# Altium schematic sheet Motor_control.SchDoc
size A4
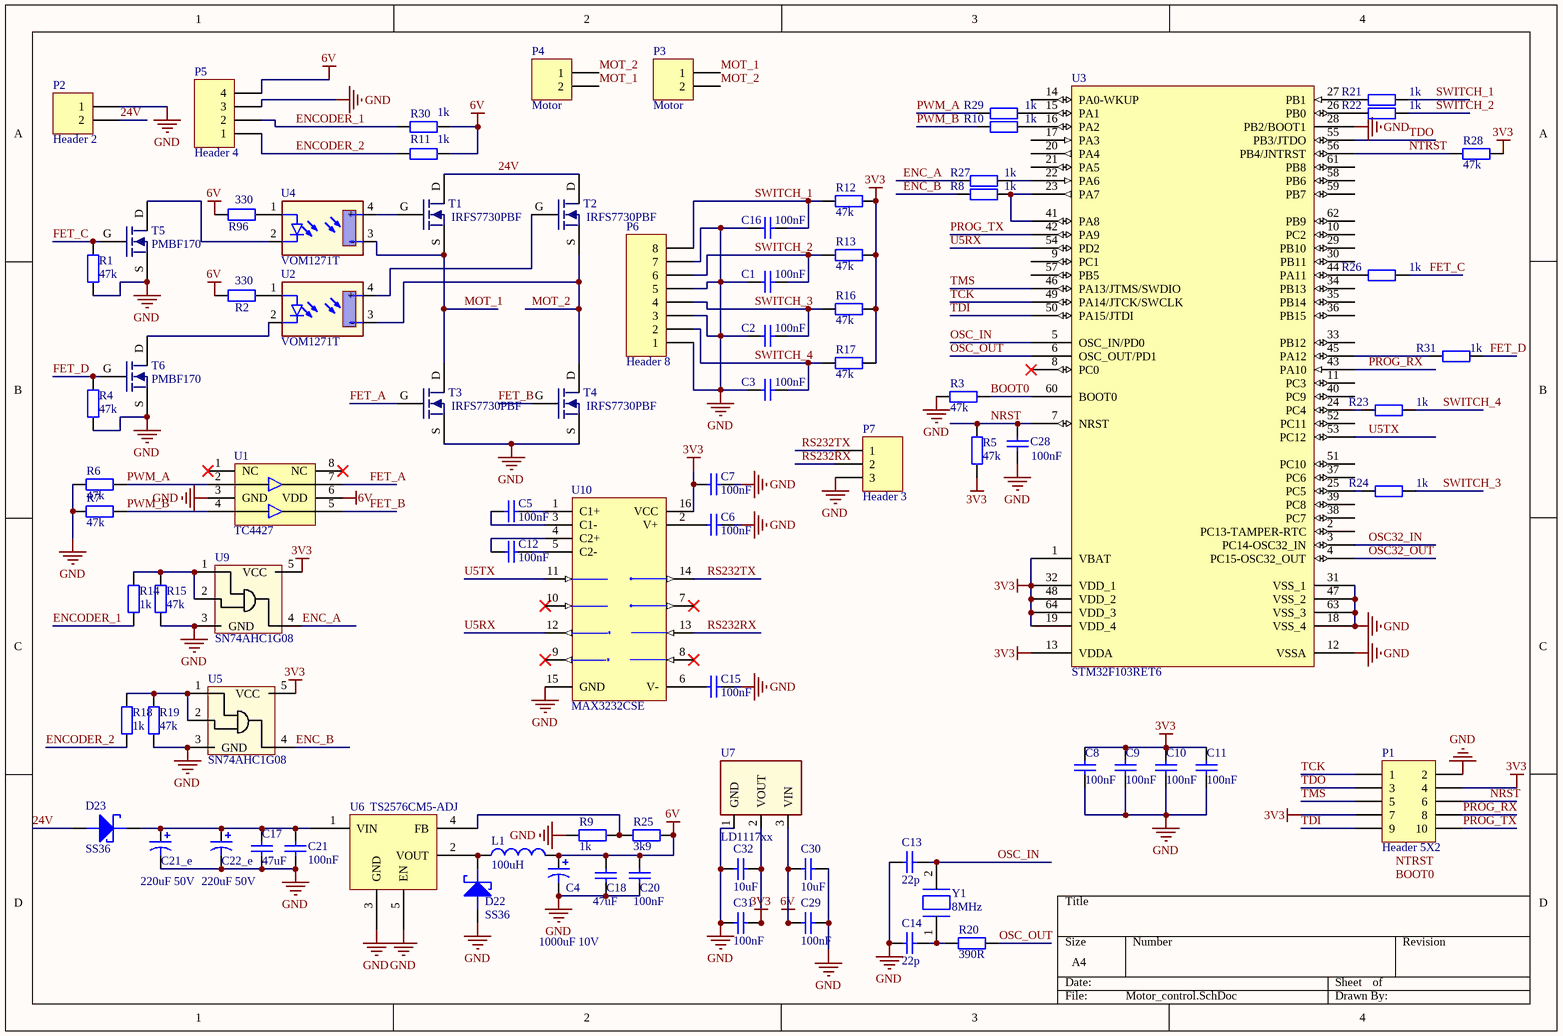
[diagram p0: Motor_control.SchDoc]

## Parts
C1  100nF  [FP_0603_CAP_080]
C2  100nF  [FP_0603_CAP_080]
C3  100nF  [FP_0603_CAP_080]
C4  1000uF 10V  [CAP_ALU_ELKO_10D_10,5H]
C5  100nF  [FP_0603_CAP_080]
C6  100nF  [FP_0603_CAP_080]
C7  100nF  [FP_0603_CAP_080]
C8  100nF  [FP_0603_CAP_080]
C9  100nF  [FP_0603_CAP_080]
C10  100nF  [FP_0603_CAP_080]
C11  100nF  [FP_0603_CAP_080]
C12  100nF  [FP_0603_CAP_080]
C13  22p  [FP_0603_CAP_080]
C14  22p  [FP_0603_CAP_080]
C15  100nF  [FP_0603_CAP_080]
C16  100nF  [FP_0603_CAP_080]
C17  47uF  [FP_1206_CAP_125]
C18  47uF  [FP_1206_CAP_125]
C20  100nF  [FP_0603_CAP_080]
C21  100nF  [FP_0603_CAP_080]
C21_e  220uF 50V  [CAP_ALU_ELKO_10D_10,5H]
C22_e  220uF 50V  [CAP_ALU_ELKO_10D_10,5H]
C28  100nF  [FP_0603_CAP_080]
C29  100nF  [FP_0603_CAP_080]
C30  10uF  [FP_1206_CAP_085]
C31  100nF  [FP_0603_CAP_080]
C32  10uF  [FP_1206_CAP_085]
D22  SS36  [DIODE_SMC]
D23  SS36  [DIODE_SMC]
L1  100uH  [SRR1206_T]
P1  Header 5X2  [HEADER_10_BOX]
P2  Header 2  [Sorkapocs 2P 5mm]
P3  Motor  [Sorkapocs 2P 5mm]
P4  Motor  [3.96mm 2P  90° NCW396-02R]
P5  Header 4  [jst-s4b-xh-a]
P6  Header 8  [Sorkapocs 8P 5mm]
P7  Header 3  [Sorkapocs 3P 5mm]
R1  47k  [FP_0603_RES]
R2  330  [FP_0603_RES]
R3  47k  [FP_0603_RES]
R4  47k  [FP_0603_RES]
R5  47k  [FP_0603_RES]
R6  47k  [FP_0603_RES]
R7  47k  [FP_0603_RES]
R8  1k  [FP_0603_RES]
R9  1k  [FP_0603_RES]
R10  1k  [FP_0603_RES]
R11  1k  [FP_0603_RES]
R12  47k  [FP_0603_RES]
R13  47k  [FP_0603_RES]
R14  1k  [FP_0603_RES]
R15  47k  [FP_0603_RES]
R16  47k  [FP_0603_RES]
R17  47k  [FP_0603_RES]
R18  1k  [FP_0603_RES]
R19  47k  [FP_0603_RES]
R20  390R  [FP_0603_RES]
R21  1k  [FP_0603_RES]
R22  1k  [FP_0603_RES]
R23  1k  [FP_0603_RES]
R24  1k  [FP_0603_RES]
R25  3k9  [FP_0603_RES]
R26  1k  [FP_0603_RES]
R27  1k  [FP_0603_RES]
R28  47k  [FP_0603_RES]
R29  1k  [FP_0603_RES]
R30  1k  [FP_0603_RES]
R31  1k  [FP_0603_RES]
R96  330  [FP_0603_RES]
T1  IRFS7730PBF  [FET_D2-PAK_7]
T2  IRFS7730PBF  [FET_D2-PAK_7]
T3  IRFS7730PBF  [FET_D2-PAK_7]
T4  IRFS7730PBF  [FET_D2-PAK_7]
T5  PMBF170  [FET_SOT23]
T6  PMBF170  [FET_SOT23]
U1  TC4427  [DIGITAL_SOIC8]
U2  VOM1271T  [OPTO_SOP-4]
U3  STM32F103RET6  [LQFP64_N]
U4  VOM1271T  [OPTO_SOP-4]
U5  SN74AHC1G08  [GATE_SOT23-5]
U6  TS2576CM5-ADJ  [SUPPLY_TO-263 5]
U7  LD1117xx  [SUPPLY_SOT223]
U9  SN74AHC1G08  [GATE_SOT23-5]
U10  MAX3232CSE  [DIGITAL_SOIC16]
Y1  value 8MHz  [FP_CRYSTAL_HC49_SMD]  (hidden comment: 8MHz Quartz HC49)

## Nets
3V3: C7.2 C8.2 C9.2 C10.2 C11.2 C31.1 C32.2 P1.4 P1.7 R5.2 R12.2 R13.2 R16.2 R17.2 R28.2 U3.1(VBAT) U3.13(VDDA) U3.19(VDD_4) U3.32(VDD_1) U3.48(VDD_2) U3.64(VDD_3) U5.5(VCC) U7.2(VOUT) U9.5(VCC) U10.16(VCC)
6V: C4.P C18.2 C20.1 C29.2 C30.1 L1.2 P5.4 R2.2 R11.2 R25.1 R30.2 R96.2 U1.6(VDD) U7.3(VIN)
GND: C1.1 C2.1 C3.1 C4.N C6.1 C7.1 C8.1 C9.1 C10.1 C11.1 C13.1 C14.2 C15.1 C16.1 C17.1 C18.1 C20.2 C21.2 C21_e.N C22_e.N C28.2 C29.1 C30.2 C31.2 C32.1 D22.A P1.2 P2.1 P5.3 P6.1 P6.3 P6.5 P6.7 P7.3 R1.2 R3.1 R4.2 R6.1 R7.1 R9.1 R15.2 R19.2 T3.S T4.S T5.S T6.S U1.3(GND) U3.12(VSSA) U3.18(VSS_4) U3.28(PB2/BOOT1) U3.31(VSS_1) U3.47(VSS_2) U3.63(VSS_3) U5.3(GND) U6.3(GND) U6.5(EN) U7.1(GND) U9.3(GND) U10.15(GND)
24V: D23.A P2.2 T1.D T2.D
BOOT0: R3.2 U3.60(BOOT0)
ENC_A: R27.1 U9.4(Y)
ENC_B: R8.1 U5.4(Y)
ENCODER_1: P5.2 R14.2 R30.1
ENCODER_2: P5.1 R11.1 R18.2
FET_A: T3.G U1.7(~{OUTA})
FET_B: T4.G U1.5(OUTB)
FET_C: R1.1 R26.2 T5.G
FET_D: R4.1 R31.2 T6.G
MOT_1: P3.1 P4.2 T1.S T3.D U4.3(-)
MOT_2: P3.2 P4.1 T2.S T4.D U2.3(-)
NRST: C28.1 P1.6 R5.1 U3.7(NRST)
NTRST: R28.1 U3.56(PB4/JNTRST)
OSC32_IN: U3.3(PC14-OSC32_IN)
OSC32_OUT: U3.4(PC15-OSC32_OUT)
OSC_IN: C13.2 U3.5(OSC_IN/PD0) Y1.2
OSC_OUT: R20.2 U3.6(OSC_OUT/PD1)
PROG_RX: P1.8 U3.43(PA10)
PROG_TX: P1.10 U3.42(PA9)
PWM_A: R6.2 R29.1 U1.2(INA)
PWM_B: R7.2 R10.1 U1.4(INB)
RS232RX: P7.2 U10.13(R1IN)
RS232TX: P7.1 U10.14(T1OUT)
SWITCH_1: C16.2 P6.8 R12.1 R21.2
SWITCH_2: C1.2 P6.6 R13.1 R22.2
SWITCH_3: C2.2 P6.4 R16.1 R24.2
SWITCH_4: C3.2 P6.2 R17.1 R23.2
TCK: P1.1 U3.49(PA14/JTCK/SWCLK)
TDI: P1.9 U3.50(PA15/JTDI)
TDO: P1.3 U3.55(PB3/JTDO)
TMS: P1.5 U3.46(PA13/JTMS/SWDIO)
U5RX: U3.54(PD2) U10.12(R1OUT)
U5TX: U3.53(PC12) U10.11(T1IN)
NetC5_1: C5.1 U10.1(C1+)
NetC5_2: C5.2 U10.3(C1-)
NetC6_2: C6.2 U10.2(V+)
NetC12_1: C12.1 U10.5(C2-)
NetC12_2: C12.2 U10.4(C2+)
NetC14_1: C14.1 R20.1 Y1.1
NetC15_2: C15.2 U10.6(V-)
NetC17_2: C17.2 C21.1 C21_e.P C22_e.P D23.K U6.1(VIN)
NetD22_K: D22.K L1.1 U6.2(VOUT)
NetR2_1: R2.1 U2.1(A)
NetR8_2: R8.2 U3.23(PA7) U3.41(PA8)
NetR9_2: R9.2 R25.2 U6.4(FB)
NetR10_2: R10.2 U3.16(PA2)
NetR14_1: R14.1 R15.1 U9.1(A) U9.2(B)
NetR18_1: R18.1 R19.1 U5.1(A) U5.2(B)
NetR21_1: R21.1 U3.27(PB1)
NetR22_1: R22.1 U3.26(PB0)
NetR23_1: R23.1 U3.24(PC4)
NetR24_1: R24.1 U3.25(PC5)
NetR26_1: R26.1 U3.44(PA11)
NetR27_2: R27.2 U3.22(PA6)
NetR29_2: R29.2 U3.15(PA1)
NetR31_1: R31.1 U3.45(PA12)
NetR96_1: R96.1 U4.1(A)
NetT1_G: T1.G U4.4(+)
NetT2_G: T2.G U2.4(+)
NetT5_D: T5.D U4.2(K)
NetT6_D: T6.D U2.2(K)

Not connected (* = marked no-connect by the designer): U1 1(NC)* 8(NC)*; U3 2(PC13-TAMPER-RTC) 8(PC0)* 9(PC1) 10(PC2) 11(PC3) 14(PA0-WKUP) 17(PA3) 20(PA4) 21(PA5) 29(PB10) 30(PB11) 33(PB12) 34(PB13) 35(PB14) 36(PB15) 37(PC6) 38(PC7) 39(PC8) 40(PC9) 51(PC10) 52(PC11) 57(PB5) 58(PB6) 59(PB7) 61(PB8) 62(PB9); U10 7(T2OUT)* 8(R2IN)* 9(R2OUT)* 10(T2IN)*

## Notes on the sheet
- Labels drawn without touching a wire or pin: BOOT0, NTRST

## Library data of the parts
C1-C3 C16 = Cap: Capacitor; Tûrés: 10%; Voltage: 50V; Value: 100nF; Order info: 82-04-85
C4 = Cap Pol1: Polarized Capacitor (Radial); Leírás: Capacitor electrolytic 1000uF 10V 10x10.2; Value: 1000uF 10V; Order info: 91-01-02
C5-C12 C15 = CAP: Capacitor; Tûrés: 10%; Value: 100nF; Order info: 82-04-85
C13 C14 = Cap: Capacitor; Published: 8-Jun-2000; LatestRevisionDate: 17-Jul-2002; LatestRevisionNote: Re-released for DXP Platform.; PackageReference: RAD-0.3; Publisher: Altium Limited; Value: 22p; Order info: 82-02-18
C17 C18 C20 C21 C28 C29 C31 = Cap: Capacitor; Tûrés: 10%
  C17 C18: Value: 47uF; Order info: 82-08-04
  C20 C21 C28: Value: 100nF; Order info: 82-04-85
  C29 C31: Published: 8-Jun-2000; LatestRevisionDate: 17-Jul-2002; LatestRevisionNote: Re-released for DXP Platform.; PackageReference: RAD-0.3; Publisher: Altium Limited; Value: 100nF; Order info: 82-04-85
C21_e C22_e = Cap Pol1: Polarized Capacitor (Radial); Leírás: Capacitor electrolytic 220uF 50V 10x10.2; Value: 220uF 50V; Order info: 91-00-96
C30 C32 = Cap: Capacitor; Value: 100nF; Tûrés: 20% X7R; Published: 8-Jun-2000; LatestRevisionDate: 17-Jul-2002; LatestRevisionNote: Re-released for DXP Platform.; PackageReference: RAD-0.3; Publisher: Altium Limited; Order info: 82-08-03
D22 D23 = SCHOTTKY: NXP - PMEG3020EJ,115 - SCHOTTKY RECT 30V 2A SOD323F; Leírás: Diode 3A 60V DO-214AB SCH.RECT. SS36; Order info: 83-02-57
L1 = Inductor: Code_IEC: 1005; Published: 8-Jun-2000; LatestRevisionDate: 29-May-2009; LatestRevisionNote: IPC-7351 Footprint Added.; PackageReference: 0402-A; Publisher: Altium Limited; PackageDescription: Chip Inductor; Code_JEITA: 0402; Order info: 93-03-42
P1 = Header 5X2: Header, 5-Pin, Dual row; LatestRevisionDate: 17-Jul-2002; LatestRevisionNote: Re-released for DXP Platform.; Publisher: Altium Limited; Order info: 43-20-93
P2-P4 = Header 2: Header, 2-Pin
  P2 P3: Order info: 43-06-54
  P4: Order info: 43-12-66
P5 = Header 4: Header, 4-Pin; Order info: 43-17-55
P6 = Header 8: Header, 8-Pin; Order info: 4 db: 43-06-54
P7 = Header 3: Header, 3-Pin; Order info: 43-06-55
R1 R3-R19 R21-R31 = Res3: Resistor; Tûrés: 5%
  R1 R3-R7 R12 R13 R15-R17 R19 R28: Value: 47k; Order info: 81-10-46
  R8-R11 R14 R18 R21-R24 R26 R27 R29-R31: Value: 1k; Order info: 81-10-26
  R25: Value: 3k9; Order info: 81-10-33
R2 R96 = Res3: Resistor; Tûrés: 1%; Value: 330; Order info: 81-17-48
R20 = RES: Resistor; Value: 390R; Order info: 81-10-21
T1-T6 = NMOS
  T1-T4: Order info: http://hu.farnell.com/international-rectifier/irfs3107-7ppbf/mosfet-n-ch-75v-d2pak/dp/1688587
  T5 T6: Order info: 86-01-96
U1 = TC4427: 1.5A Dual High-Speed Power MOSFET Driver; Order info: 89-22-85
U2 U4 = VOM1271T: Photodiode Output Optocouplers MOSFET DRVR ISOLATED SOP4; Order info: http://hu.farnell.com/vishay-semiconductor/vom1271t/driver-mosfet-high-side-sop-4/dp/2395899
U3 = STM32F103RBT6: STM32 ARM-based 32-bit MCU with 256 Kbytes Flash, 64-pin LQFP, Industrial Temperature; Order info: http://hu.farnell.com/stmicroelectronics/stm32f100rct6tr/mcu-32bit-cortex-m3-24mhz-lqfp/dp/2333147
U5 U9 = SN74AHC1G08: 1x2-INPUT AND-GATE; Leírás: AND-GATE 1x2-INPUT; Order info: 87-02-78
U6 = TS2576: Step Down DC-DC Converter; Order info: 89-09-12
U7 = LD1117xx: LD1117xx 3,3V lin reg; Order info: 89-06-98
U10 = MAX3232CSE: MAX3232CSE 3.3.V RS232 converter; Order info: 89-12-11
Y1 = XTAL HC49: Standard HC49 quartz; Manufacturer: Siward; Order info: 40-01-23